# EAGLE schematic Swarm Board (EAGLE 6.2)
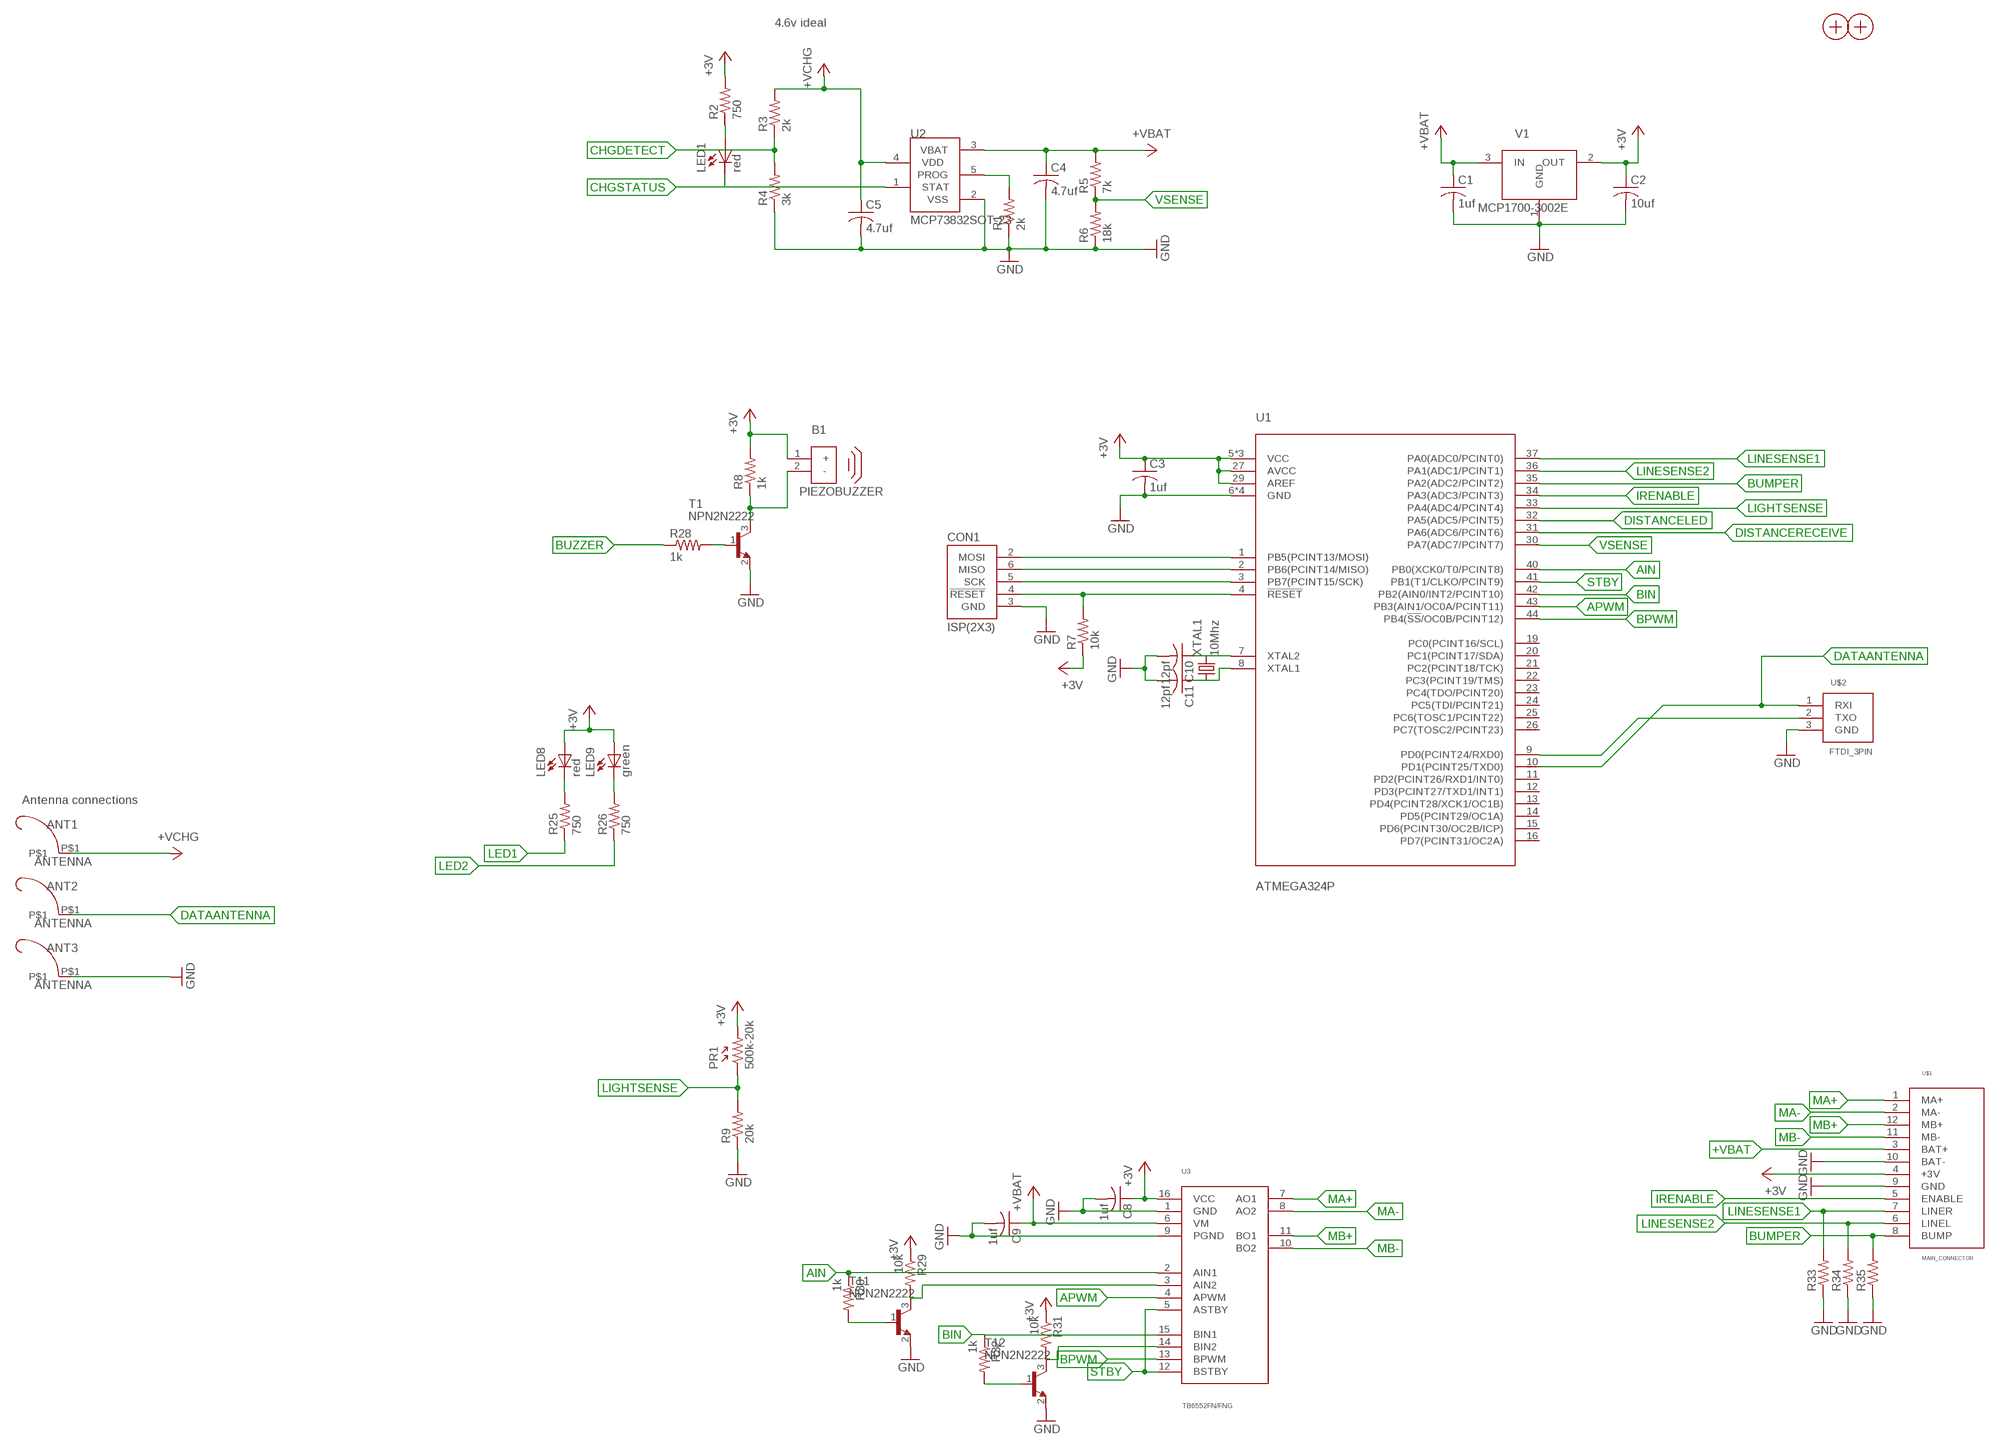
[diagram p0: schematic, sheet 1, part 1 of 2]
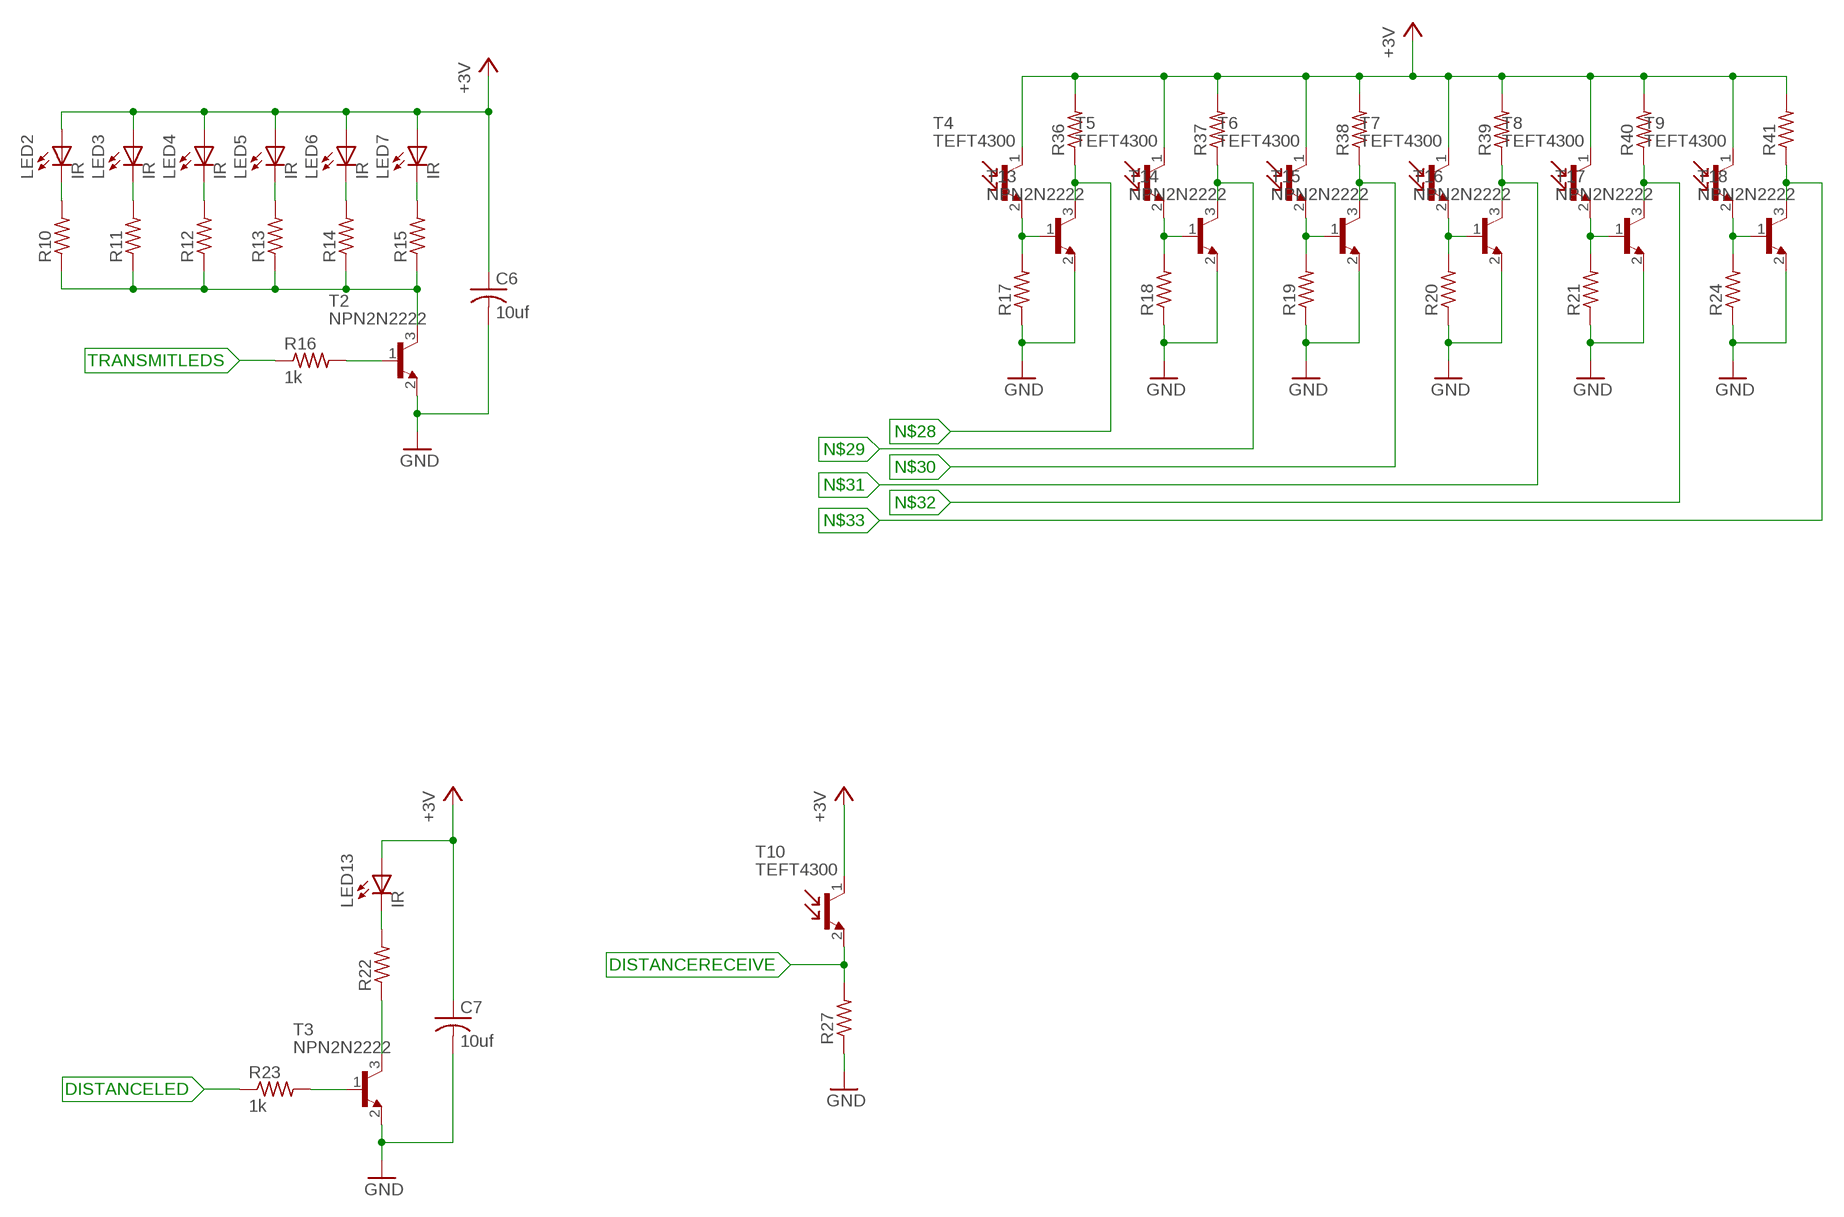
[diagram p1: schematic, sheet 1, part 2 of 2]

## Parts
ANT1  ANTENNA  [ANTENNA]
ANT2  ANTENNA  [ANTENNA]
ANT3  ANTENNA  [ANTENNA]
B1  PIEZOBUZZER  [PIEZOBUZZER]
C1  1uf  CAP0603  [0603]
C2  10uf  CAP0805  [0805]
C3  1uf  CAP0603  [0603]
C4  4.7uf  CAP0603  [0603]
C5  4.7uf  CAP0603  [0603]
C6  10uf  CAP0805  [0805]
C7  10uf  CAP0805  [0805]
C8  1uf  CAP0603  [0603]
C9  1uf  CAP0603  [0603]
C10  12pf  CAP0603  [0603]
C11  12pf  CAP0603  [0603]
CON1  ISP(2X3)  [PINHEADER(2X3)]
H1  MOUNTINGHOLE  [MOUNTINGHOLE]
H2  MOUNTINGHOLE  [MOUNTINGHOLE]
LED1  red  LED0603  [0603]
LED2  IR  LED5MMRA  [5MM_LED_RA]
LED3  IR  LED5MMRA  [5MM_LED_RA]
LED4  IR  LED5MMRA  [5MM_LED_RA]
LED5  IR  LED5MMRA  [5MM_LED_RA]
LED6  IR  LED5MMRA  [5MM_LED_RA]
LED7  IR  LED5MMRA  [5MM_LED_RA]
LED8  red  LED0603  [0603]
LED9  green  LED0603  [0603]
LED13  IR  LED5MMRA  [5MM_LED_RA]
PR1  500k-20k  CDSPHOTORESISTOR  [CDSPHOTOCELL]
R1  2k  RES0603  [0603]
R2  750  RES0603  [0603]
R3  2k  RES0603  [0603]
R4  3k  RES0603  [0603]
R5  7k  RES0603  [0603]
R6  18k  RES0603  [0603]
R7  10k  RES0603  [0603]
R8  1k  RES0603  [0603]
R9  20k  RES0603  [0603]
R10  RES0603  [0603]
R11  RES0603  [0603]
R12  RES0603  [0603]
R13  RES0603  [0603]
R14  RES0603  [0603]
R15  RES0603  [0603]
R16  1k  RES0603  [0603]
R17  RES0603  [0603]
R18  RES0603  [0603]
R19  RES0603  [0603]
R20  RES0603  [0603]
R21  RES0603  [0603]
R22  RES0603  [0603]
R23  1k  RES0603  [0603]
R24  RES0603  [0603]
R25  750  RES0603  [0603]
R26  750  RES0603  [0603]
R27  RES0603  [0603]
R28  1k  RES0603  [0603]
R29  10k  RES0603  [0603]
R30  1k  RES0603  [0603]
R31  10k  RES0603  [0603]
R32  1k  RES0603  [0603]
R33  RES0603  [0603]
R34  RES0603  [0603]
R35  RES0603  [0603]
R36  RES0603  [0603]
R37  RES0603  [0603]
R38  RES0603  [0603]
R39  RES0603  [0603]
R40  RES0603  [0603]
R41  RES0603  [0603]
T1  NPN2N2222  [SOT23]
T2  NPN2N2222  [SOT23]
T3  NPN2N2222  [SOT23]
T4  TEFT4300  [3MM_LED_RA]
T5  TEFT4300  [3MM_LED_RA]
T6  TEFT4300  [3MM_LED_RA]
T7  TEFT4300  [3MM_LED_RA]
T8  TEFT4300  [3MM_LED_RA]
T9  TEFT4300  [3MM_LED_RA]
T10  TEFT4300  [3MM_LED_RA]
T11  NPN2N2222  [SOT23]
T12  NPN2N2222  [SOT23]
T13  NPN2N2222  [SOT23]
T14  NPN2N2222  [SOT23]
T15  NPN2N2222  [SOT23]
T16  NPN2N2222  [SOT23]
T17  NPN2N2222  [SOT23]
T18  NPN2N2222  [SOT23]
U1  ATMEGA324P  [TQFP44]
U2  MCP73832SOT-23  [(OT)SOT-23(5PAD)]
U3  TB6552FN/FNG  [16SSOP]
U$1  MAIN_CONNECTOR  [FEMALE_HEADER_2MM_2X6]
U$2  FTDI_3PIN  [3PINHEADER_.100"]
V1  MCP1700-3002E  [(TT/NB)SOT-23(3PAD)]
XTAL1  10Mhz  NX5032GA-10.000000MHZ  [SMDXTAL]

## Nets
+3V: B1.1(+) C2.1 C3.1 C6.1 C7.1 C8.1 LED2.1(A) LED3.1(A) LED4.1(A) LED5.1(A) LED6.1(A) LED7.1(A) LED8.2(A) LED9.2(A) LED13.1(A) PR1.2 R2.2 R7.1 R8.2 R29.1 R31.1 R36.2 R37.2 R38.2 R39.2 R40.2 R41.2 T4.1(C) T5.1(C) T6.1(C) T7.1(C) T8.1(C) T9.1(C) T10.1(C) U1.5(VCC) U1.17(VCC) U1.27(AVCC) U1.29(AREF) U1.38(VCC) U3.16(VCC) U$1.4(+3V) V1.2(OUT)
+VBAT: C1.1 C4.1 C9.1 R5.2 U2.3(VBAT) U3.6(VM) U$1.3(BAT+) V1.3(IN)
+VCHG: ANT1.P$1 C5.1 R3.2 U2.4(VDD)
AIN: R30.1 U1.40(PB0(XCK0/T0/PCINT8)) U3.2(AIN1)
AIN2: R29.2 T11.3(C) U3.3(AIN2)
APWM: U1.43(PB3(AIN1/OC0A/PCINT11)) U3.4(APWM)
BIN: R32.1 U1.42(PB2(AIN0/INT2/PCINT10)) U3.15(BIN1)
BIN2: R31.2 T12.3(C) U3.14(BIN2)
BPWM: U1.44(PB4(!SS!/OC0B/PCINT12)) U3.13(BPWM)
BUMPER: R35.2 U1.35(PA2(ADC2/PCINT2)) U$1.8(BUMP)
BUZZER: R28.1
CHGDETECT: R3.1 R4.2
CHGSTATUS: LED1.1(C) U2.1(STAT)
DATAANTENNA: ANT2.P$1 U1.10(PD1(PCINT25/TXD0)) U$2.1(RXI)
DISTANCELED: R23.1 U1.32(PA5(ADC5/PCINT5))
DISTANCERECEIVE: R27.2 T10.2(E) U1.31(PA6(ADC6/PCINT6))
GND: ANT3.P$1 C1.2 C2.2 C3.2 C4.2 C5.2 C6.2 C7.2 C8.2 C9.2 C10.2 C11.2 CON1.3(GND) R1.1 R4.1 R6.1 R9.1 R17.1 R18.1 R19.1 R20.1 R21.1 R24.1 R27.1 R33.1 R34.1 R35.1 T1.2(E) T2.2(E) T3.2(E) T11.2(E) T12.2(E) T13.2(E) T14.2(E) T15.2(E) T16.2(E) T17.2(E) T18.2(E) U1.6(GND) U1.18(GND) U1.28(GND) U1.39(GND) U2.2(VSS) U3.1(GND) U3.9(PGND) U$1.9(GND) U$1.10(BAT-) U$2.3(GND) V1.1(GND)
IRENABLE: U1.34(PA3(ADC3/PCINT3)) U$1.5(ENABLE)
LED1: R25.1
LED2: R26.1
LIGHTSENSE: PR1.1 R9.2 U1.33(PA4(ADC4/PCINT4))
LINESENSE1: R33.2 U1.37(PA0(ADC0/PCINT0)) U$1.7(LINER)
LINESENSE2: R34.2 U1.36(PA1(ADC1/PCINT1)) U$1.6(LINEL)
MA+: U3.7(AO1) U$1.1(MA+)
MA-: U3.8(AO2) U$1.2(MA-)
MB+: U3.11(BO1) U$1.12(MB+)
MB-: U3.10(BO2) U$1.11(MB-)
N$1: R1.2 U2.5(PROG)
N$2: CON1.2(MOSI) U1.1(PB5(PCINT13/MOSI))
N$3: CON1.6(MISO) U1.2(PB6(PCINT14/MISO))
N$4: LED1.2(A) R2.1
N$5: CON1.5(SCK) U1.3(PB7(PCINT15/SCK))
N$6: CON1.4(!RESET) R7.2 U1.4(!RESET)
N$7: R32.2 T12.1(B)
N$8: U1.9(PD0(PCINT24/RXD0)) U$2.2(TXO)
N$9: B1.2(-) R8.1 T1.3(C)
N$10: R10.1 R11.1 R12.1 R13.1 R14.1 R15.1 T2.3(C)
N$11: R16.2 T2.1(B)
N$12: R22.1 T3.3(C)
N$13: LED2.2(C) R10.2
N$14: LED3.2(C) R11.2
N$15: LED4.2(C) R12.2
N$16: LED5.2(C) R13.2
N$17: LED6.2(C) R14.2
N$18: LED7.2(C) R15.2
N$19: R23.2 T3.1(B)
N$20: LED8.1(C) R25.2
N$21: LED9.1(C) R26.2
N$22: R30.2 T11.1(B)
N$23: C10.1 U1.7(XTAL2) XTAL1.2
N$24: C11.1 U1.8(XTAL1) XTAL1.1
N$25: LED13.2(C) R22.2
N$26: R28.2 T1.1(B)
N$27: R17.2 T4.2(E) T13.1(B)
N$28: R36.1 T13.3(C)
N$29: R37.1 T14.3(C)
N$30: R38.1 T15.3(C)
N$31: R39.1 T16.3(C)
N$32: R40.1 T17.3(C)
N$33: R41.1 T18.3(C)
N$34: R24.2 T9.2(E) T18.1(B)
N$35: R21.2 T8.2(E) T17.1(B)
N$36: R20.2 T7.2(E) T16.1(B)
N$37: R19.2 T6.2(E) T15.1(B)
N$38: R18.2 T5.2(E) T14.1(B)
STBY: U1.41(PB1(T1/CLKO/PCINT9)) U3.5(ASTBY) U3.12(BSTBY)
TRANSMITLEDS: R16.1
VSENSE: R5.1 R6.2 U1.30(PA7(ADC7/PCINT7))
Unconnected: U1.11(PD2(PCINT26/RXD1/INT0)) U1.12(PD3(PCINT27/TXD1/INT1)) U1.13(PD4(PCINT28/XCK1/OC1B)) U1.14(PD5(PCINT29/OC1A)) U1.15(PD6(PCINT30/OC2B/ICP)) U1.16(PD7(PCINT31/OC2A)) U1.19(PC0(PCINT16/SCL)) U1.20(PC1(PCINT17/SDA)) U1.21(PC2(PCINT18/TCK)) U1.22(PC3(PCINT19/TMS)) U1.23(PC4(TDO/PCINT20)) U1.24(PC5(TDI/PCINT21)) U1.25(PC6(TOSC1/PCINT22)) U1.26(PC7(TOSC2/PCINT23))

## Notes on the sheet
- 4.6v ideal
- Antenna connections

## Library data of the parts
ANT1-ANT3 = Mechanical:ANTENNA
B1 = Passive:PIEZOBUZZER: Digikey Part Number: 445-2525-1-ND Manufacturer Part Number: PS1240P02BT
C1-C11 = Passive:CAP
CON1 = Mechanical:ISP
H1 H2 = Mechanical:MOUNTINGHOLE
LED1-LED9 LED13 = Passive:LED
PR1 = Passive:CDSPHOTORESISTOR: Digikey Part Number: PDV-P8103-ND Manufacturer Part Number: PDV-P8103
R1-R41 = Passive:RES
T1-T3 T11-T18 = Passive:NPN2N2222: Digikey Part Number: 568-1738-1-ND Manufacturer Part Number: PMBT2222A,215
T4-T10 = Passive:TEFT4300: Digikey Part Number: 751-1041-ND Manufacturer Part number: TEFT4300
U1 = DigitalIC:ATMEGA324P: Digikey Part Number: ATMEGA324P-20AU-ND Manufacturer Part Number: ATMEGA324P-20AU
U2 = PowerIC:MCP73832: Digikey Part Number: MCP73832T-2ACI/OTCT-ND Manufacturer Part Number: MCP73832T-2ACI/OT
U3 = DigitalIC:TB6552: Digikey Part Number: TB6552FNG(OEL)CT-ND Manufacturer Part Number: TB6552FNG(O,EL)
U$1 = Mechanical:MAIN_CONNECTOR: Digikey Part Number: S5750-06-ND Manufacturer Part Number: NPPN062AFCN-RC
U$2 = Mechanical:FTDI_3PIN
V1 = PowerIC:MCP1700-3002E: Digikey Part Number: MCP1700T-3002E/TTCT-ND Manufacturer Part Number: MCP1700T-3002E/TT
XTAL1 = Passive:NX5032GA-10.000000MHZ: Digikey Part Number: 644-1033-1-ND Manufacturer Part Number: NX5032GA-10.000000MHZ-LN-CD-1